# EAGLE design bridge (EAGLE 6.6.0)
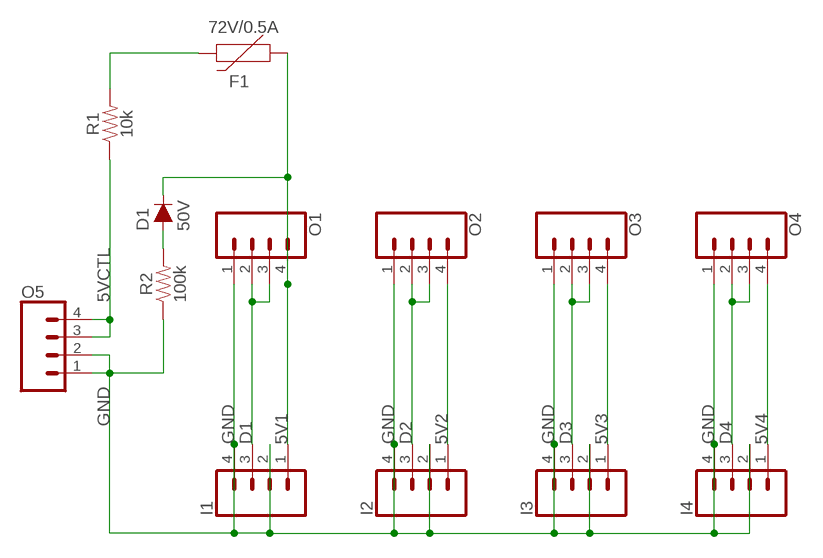
[diagram p0: schematic, sheet 1]

## Parts
D1  50V  DIODE-PTH  [DIODE-1N4001]
F1  72V/0.5A  PPTC_PTH  [PTH]
I1  CONN_04SCREW  [SCREWTERMINAL-3.5MM-4]
I2  CONN_04SCREW  [SCREWTERMINAL-3.5MM-4]
I3  CONN_04SCREW  [SCREWTERMINAL-3.5MM-4]
I4  CONN_04SCREW  [SCREWTERMINAL-3.5MM-4]
O1  CONN_04SCREW  [SCREWTERMINAL-3.5MM-4]
O2  CONN_04SCREW  [SCREWTERMINAL-3.5MM-4]
O3  CONN_04SCREW  [SCREWTERMINAL-3.5MM-4]
O4  CONN_04SCREW  [SCREWTERMINAL-3.5MM-4]
O5  CONN_04SCREW  [SCREWTERMINAL-3.5MM-4]
R1  10k  10KOHM-HORIZ-1/4W-1%  [AXIAL-0.3]
R2  100k  100KOHM-HORIZ-1/4W-1%  [AXIAL-0.3]

## Nets
5V1: D1.C F1.P$1 I1.1 O1.4
5V2: I2.1 O2.4
5V3: I3.1 O3.4
5V4: I4.1 O4.4
5VCTL: O5.3 O5.4 R1.P$1
D1: I1.3 O1.2 O1.3
D2: I2.3 O2.2 O2.3
D3: I3.3 O3.2 O3.3
D4: I4.3 O4.2 O4.3
GND: I1.2 I1.4 I2.2 I2.4 I3.2 I3.4 I4.2 I4.4 O1.1 O2.1 O3.1 O4.1 O5.1 O5.2 R2.P$1
N$1: F1.P$2 R1.P$2
N$3: D1.A R2.P$2

## Library data of the parts
D1 = SparkFun-DiscreteSemi:DIODE: Diode These are standard reverse protection diodes and small signal diodes. SparkFun Products: SparkFun SparkPunk Sound Kit <https://www.sparkfun.com/products/11177> SparkFun ESP8266 Thing <https://www.sparkfun.com/products/13231>; PROD_ID: DIO-09176; VALUE: 1A/50V/1.1V
F1 = SparkFun-Fuses:PPTC: Resettable Fuse PPTC Resettable Fuse. Really a sort of resistor with a polymeric positive temperature coefficient whose resistance increases dramatically with an increase in temperature. When heated by the power passing through the resistance rises causing the current to be limited, protecting the circuit. This is achieved by the transition of the polymer from a crystalline to an amorphous state where the conductive carbon separates breaking the conductive pathways found in the cool crystalline structure. When a PPTC cools back down it resumes conducting letting the circuit turn back on. SparkFun Products: SparkFun RedBoard - Programmed with Arduino <https://www.sparkfun.com/products/12757> Pro Micro - 5V/16MHz <https://www.sparkfun.com/products/12640> Arduino Pro 328 - 5V/16MHz <https://www.sparkfun.com/products/10915> MP3 Trigger <https://www.sparkfun.com/products/13720>; PROD_ID: RES-08490; VALUE: 72V/0.25A
I1-I4 O1-O5 = SparkFun-Connectors:CONN_04: Multi connection point. Often used as Generic Header-pin footprint for 0.1 inch spaced/style header connections On any of the 0.1 inch spaced packages, you can populate with these: Break Away Headers - Straight <https://www.sparkfun.com/products/116> (PRT-00116) Break Away Male Headers - Right Angle <https://www.sparkfun.com/products/553> (PRT-00553) Female Headers <https://www.sparkfun.com/products/115> (PRT-00115) Break Away Headers - Machine Pin <https://www.sparkfun.com/products/117> (PRT-00117) Break Away Female Headers - Swiss Machine Pin <https://www.sparkfun.com/products/743> (PRT-00743) For SCREWTERMINALS and SPRING TERMINALS visit here: Screw Terimnals on SparkFun.com <https://www.sparkfun.com/search/results?term=Screw+Terminals> (5mm/3.5mm/2.54mm spacing) This device is also useful as a general connection point to wire up your design to another part of your project. Our various solder wires solder well into these plated through hole pads. Hook-Up Wire - Assortment (Stranded, 22 AWG) <https://www.sparkfun.com/products/11375> (PRT-11375) Hook-Up Wire - Assortment (Solid Core, 22 AWG) <https://www.sparkfun.com/products/11367> (PRT-11367) View the entire wire category on our website here <https://www.sparkfun.com/categories/141> Special notes: Molex polarized connector foot print use with SKU : PRT-08231 with associated crimp pins and housings. 1MM SMD Version SKU: PRT-10208; PROD_ID: 2xCONN-08399; SF_ID: 2xPRT-08084
R1 = SparkFun-Resistors:10KOHM: 10kΩ resistor A resistor is a passive two-terminal electrical component that implements electrical resistance as a circuit element. Resistors act to reduce current flow, and, at the same time, act to lower voltage levels within circuits. - Wikipedia; PROD_ID: RES-12183
R2 = SparkFun-Resistors:100KOHM: 100kΩ resistor A resistor is a passive two-terminal electrical component that implements electrical resistance as a circuit element. Resistors act to reduce current flow, and, at the same time, act to lower voltage levels within circuits. - Wikipedia; PROD_ID: RES-12184

## Board
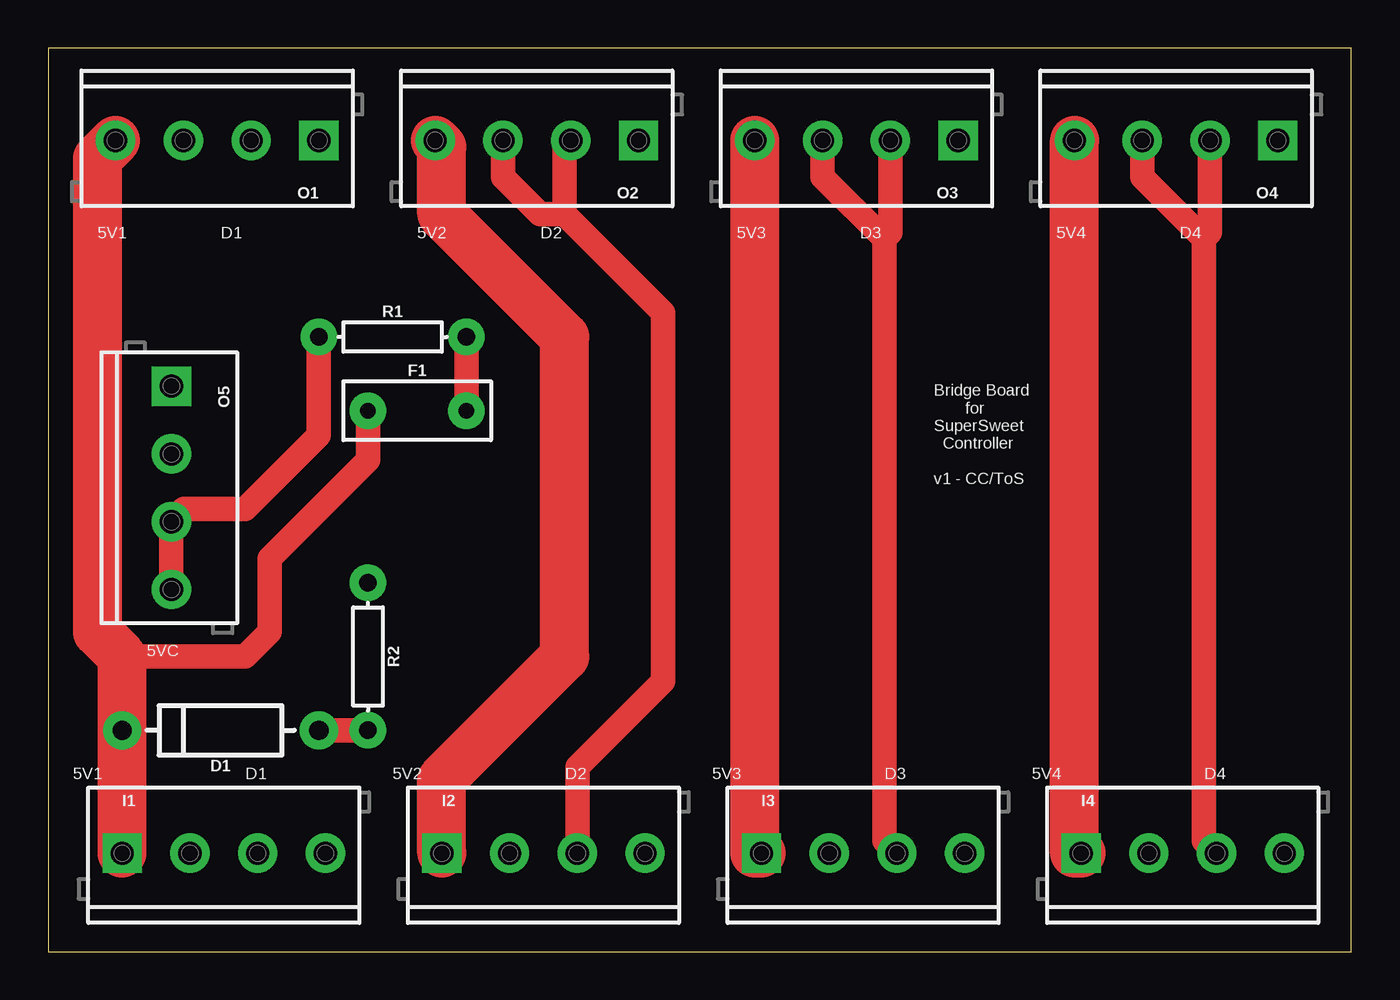
[diagram p1: board, top side]
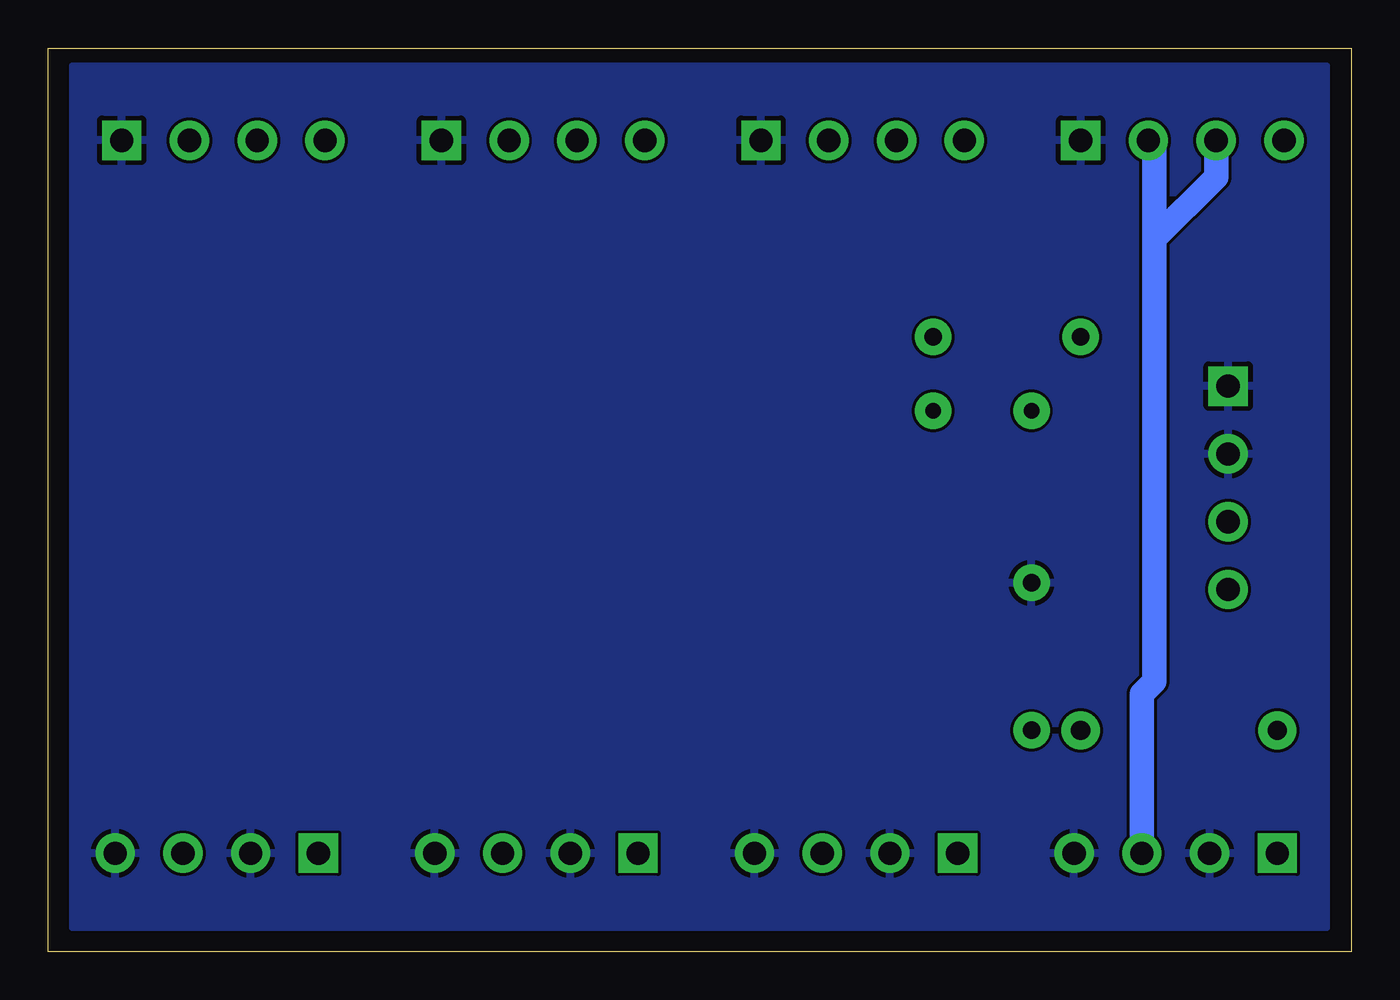
[diagram p2: board, bottom side, seen from below]

Size 67.29 x 46.66 mm. Coordinates in mm from the lower left corner, seen from the top.
Outline: 0,0 67.29,0 67.29,46.66 0,46.66 0,0
Copper layers (1*16): Top 0.035559375mm / dielectric 1.6mm / Bottom 0.035559375mm
Design rules "oshpark-2layer": minimum track width 6mil, minimum drill 10mil, track to track 6mil, track to pad 6mil, pad to pad 6mil, via to via 6mil, smd to smd 6mil, copper to edge 15mil, drill to drill 6mil, minimum pad ring 5mil, minimum via ring 5mil, stop-mask expansion 2.5mil, vias tented up to drill 0mil, thermal gap 10mil

### Footprints (pad centres in the part's own frame; a part is rotated, then mirrored left to right if it is on the bottom)
DIODE-1N4001 = drill 1 pad 1.981: A -5.08,0; C 5.08,0
PTH = drill 0.8 pad 1.88: P$1 -2.54,0; P$2 2.54,0
SCREWTERMINAL-3.5MM-4 = drill 1.2 pad 2.032 square: 1 0,0 | drill 1.2 pad 2.032: 2 3.5,0; 3 7,0; 4 10.5,0
AXIAL-0.3 = drill 0.9 pad 1.88: P$1 -3.81,0; P$2 3.81,0

### Placement (x,y rotation side)
D1  8.89,11.43 180 top
F1  19.05,27.94 0 top
I1  3.81,5.08 0 top
I2  20.32,5.08 0 top
I3  36.83,5.08 0 top
I4  53.34,5.08 0 top
O1  13.97,41.91 180 top
O2  30.48,41.91 180 top
O3  46.99,41.91 180 top
O4  63.5,41.91 180 top
O5  6.35,29.21 270 top
R1  17.78,31.75 0 top
R2  16.51,15.24 270 top

### Tracks (layer width: path | path; a pad name or v marks a point on that pad's centre or on a via)
5V1
  Top 1.27: 3.81,15.24 10.16,15.24 11.43,16.51 11.43,20.32 16.51,25.4 F1.P$1
  Top 2.54: I1.1 D1.C 3.81,15.24 2.54,16.51 2.54,40.98 O1.4
5V2
  Top 2.54: I2.1 20.32,8.89 26.67,15.24 26.67,31.75 20.32,38.1 20.32,41.57 O2.4
5V3
  Top 2.54: I3.1 36.49,5.08 O3.4
5V4
  Top 2.54: I4.1 53,5.08 O4.4
5VCTL
  Top 1.27: O5.4 O5.3 7,22.86 10.16,22.86 13.97,26.67 R1.P$1
D1
  Bottom 1.27: I1.3 10.81,13.32 10.16,13.97 10.16,36.83 | 10.16,36.83 10.16,41.6 O1.2 | O1.3 6.97,40.02 10.16,36.83
D2
  Top 1.27: I2.3 27.32,9.54 31.75,13.97 31.75,33.02 26.67,38.1 | 26.67,38.1 26.67,41.6 O2.2 | O2.3 23.48,40.02 25.4,38.1 26.67,38.1
D3
  Top 1.27: O3.3 39.99,40.02 43.18,36.83 | 43.18,36.83 43.18,5.73 I3.3 | O3.2 43.49,37.14 43.18,36.83
D4
  Top 1.27: O4.3 56.5,40.02 59.69,36.83 | 59.69,36.83 59.69,5.73 I4.3 | O4.2 60,37.14 59.69,36.83
GND
  pour Bottom: 1.27,45.72 66.04,45.72 66.04,1.27 1.27,1.27
N$1
  Top 1.27: F1.P$2 R1.P$2
N$3
  Top 1.27: D1.A R2.P$2

### Text on the board
tNames: 5V1 | D1 | 5V2 | D2 | 5V3 | D3 | 5V4 | D4 | Bridge Board / for / SuperSweet / Controller / / v1 - CC/ToS | 5VC | 5V1 | D1 | 5V2 | D2 | 5V3 | D3 | 5V4 | D4